# Altium schematic sheet RC_Servo_.SchDoc
size B
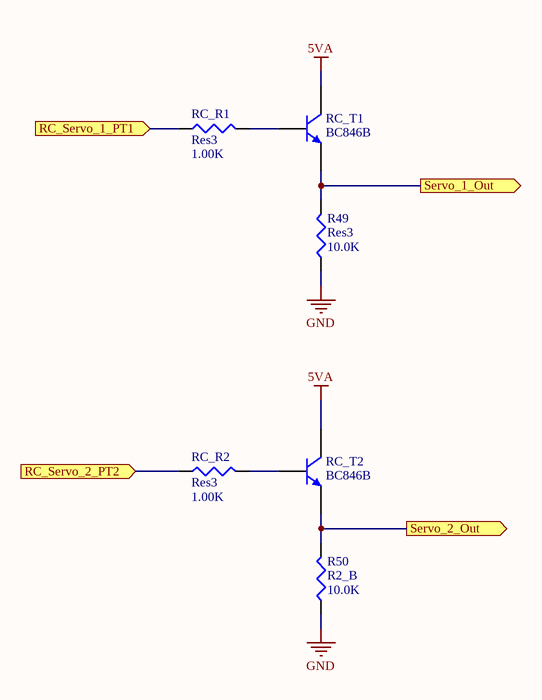
[diagram p0: RC_Servo_.SchDoc]

## Parts
R49  Res3  value 10.0K  [RESC2112X05M]
R50  R2_B  value 10.0K  [RESC2112X05M]
RC_R1  Res3  value 1.00K  [RESC2112X05M]
RC_R2  Res3  value 1.00K  [RESC2112X05M]
RC_T1  BC846B  [SOT95P230X110-3M]
RC_T2  BC846B  [SOT95P230X110-3M]

## Ports
RC_Servo_1_PT1 (in), RC_Servo_2_PT2 (in), Servo_1_Out (out), Servo_2_Out (out)

## Nets
5VA: RC_T1.3(C) RC_T2.3(C)
GND: R49.1 R50.1
RC_Servo_1_PT1: RC_R1.1 ; port RC_Servo_1_PT1
RC_Servo_2_PT2: RC_R2.1 ; port RC_Servo_2_PT2
Servo_1_Out: R49.2 RC_T1.2(E) ; port Servo_1_Out
Servo_2_Out: R50.2 RC_T2.2(E) ; port Servo_2_Out
NetRC_R1_2: RC_R1.2 RC_T1.1(B)
NetRC_R2_2: RC_R2.2 RC_T2.1(B)

## Notes on the sheet
- ESE
- is the sole property of ESE. Any reproduction
- The Information Contained in this drawing
- Schematic P/N and Name
- Sheet Name
- 299 Doon Valley Drive
- Kitchener, ON N2G 4M4
- Canada
- Approved
- in part or in whole without the written
- permission of ESE is strictly prohibited.
- APPROVALS
- DATE
- Size
- Scale
- B
- NTS
- Bare PCB P/N
- Date
- Sheet
- Rev.
- Checked
- Engineer
- of

## Library data of the parts
R49 R50 = Resistor_10.0K: RES SMD 10.0K OHM 1% 1/8W 0805; MPN: CRCW080510K0FKEA; PN: 541-10.0KCCT-ND; Name: Resistor_10.0K; URL: http://www.digikey.ca/product-detail/en/CRCW080510K0FKEA/541-10.0KCCT-ND
RC_R1 RC_R2 = Resistor_1.00K: RES SMD 1.00K OHM 1% 1/8W 0805; MPN: CRCW08051K00FKEA; PN: 541-1.00KCCT-ND; Name: Resistor_1.00K; URL: http://www.digikey.ca/product-detail/en/CRCW08051K00FKEA/541-1.00KCCT-ND
RC_T1 RC_T2 = BC846B: NPN General Purpose Amplifier; PN: 568-1632-1-ND; URL: http://www.digikey.ca/product-detail/en/BC846B,215/568-1632-1-ND/763459